# EAGLE schematic BuckConverter (EAGLE 9.6.2)
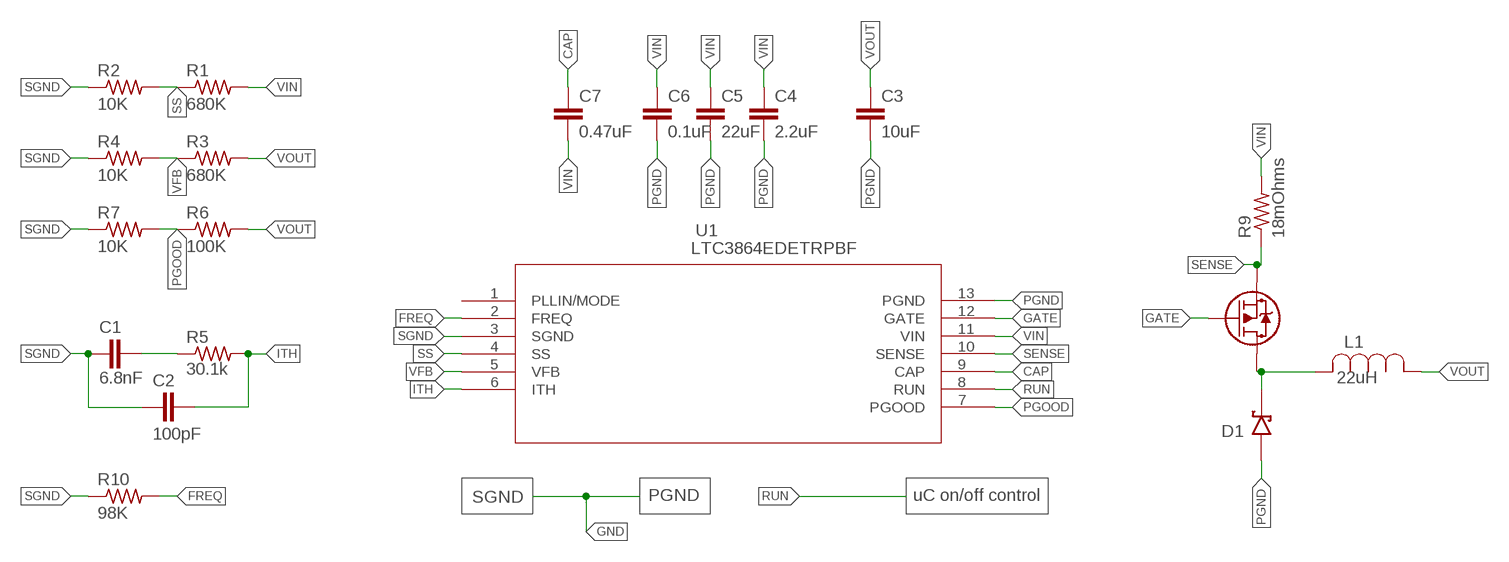
[diagram p0: schematic, sheet 1]

## Parts
C1  6.8nF  2.2UF-0805-25V-(+80/-20%)  [0805]
C2  100pF  2.2UF-0805-25V-(+80/-20%)  [0805]
C3  10uF  2.2UF-0805-25V-(+80/-20%)  [0805]
C4  2.2uF  2.2UF-0805-25V-(+80/-20%)  [0805]
C5  22uF  2.2UF-0805-25V-(+80/-20%)  [0805]
C6  0.1uF  2.2UF-0805-25V-(+80/-20%)  [0805]
C7  0.47uF  2.2UF-0805-25V-(+80/-20%)  [0805]
D1  MBR1560STR  [DIO_MBR1560STR]
L1  22uH  IHLP4040DZER6R8M01  [IND_IHLP-4040DZ_VIS]
R1  680K  R-US_M0805  [M0805]
R2  10K  R-US_M0805  [M0805]
R3  680K  R-US_M0805  [M0805]
R4  10K  R-US_M0805  [M0805]
R5  30.1k  R-US_M0805  [M0805]
R6  100K  R-US_M0805  [M0805]
R7  10K  R-US_M0805  [M0805]
R8  RSJ250P10TL  [TRANS_R5009FNJ_ROM]
R9  18mOhms  R-US_M0805  [M0805]
R10  98K  R-US_M0805  [M0805]
U1  LTC3864EDETRPBF  [DFN-12_DE]

## Nets
CAP: C7.1 U1.9(CAP)
FREQ: R10.2 U1.2(FREQ)
GATE: R8.1 U1.12(GATE)
ITH: C2.2 R5.2 U1.6(ITH)
N$2: D1.3(K) D1.4(K) L1.2 R8.2
N$3: C1.2 R5.1
PGND: C3.2 C4.2 C5.2 C6.2 D1.1(A) D1.2(A) U1.13(PGND)
PGOOD: R6.1 R7.2 U1.7(PGOOD)
RUN: U1.8(RUN)
SENSE: R8.3 R9.1 U1.10(SENSE)
SGND: C1.1 C2.1 R2.1 R4.1 R7.1 R10.1 U1.3(SGND)
SS: R1.1 R2.2 U1.4(SS)
VFB: R3.1 R4.2 U1.5(VFB)
VIN: C4.1 C5.1 C6.1 C7.2 R1.2 R9.2 U1.11(VIN)
VOUT: C3.1 L1.1 R3.2 R6.2
Unconnected: U1.1(PLLIN/MODE)

## Notes on the sheet
- SGND
- PGND | uC on/off control

## Library data of the parts
C1-C3 C5-C7 = SparkFun-Capacitors:2.2UF: 2.2µF ceramic capacitors A capacitor is a passive two-terminal electrical component used to store electrical energy temporarily in an electric field.; PROD_ID: CAP-11624; VALUE: 2.2uF
C4 = SparkFun-Capacitors:2.2UF: 2.2µF ceramic capacitors A capacitor is a passive two-terminal electrical component used to store electrical energy temporarily in an electric field.; PROD_ID: CAP-11624
D1 = MBR1560STR:MBR1560STR: Diode Schottky 60V 15A Surface Mount TO-277B; DESCRIPTION: Diode Schottky 60 V 15A Surface Mount TO-277B; MF: SMC Diode Solutions; MP: MBR1560STR; PACKAGE: TO-277 SMC Diode Solutions; PURCHASE-URL: https://pricing.snapeda.com/search/part/MBR1560STR/?ref=eda
L1 = CurrentLimiter:IHLP4040DZER6R8M01; COPYRIGHT: Copyright (C) 2022 Ultra Librarian. All rights reserved.; DIGI-KEY_PART_NUMBER_1: 541-1303-1-ND; DIGI-KEY_PART_NUMBER_2: 541-1303-2-ND; DIGI-KEY_PART_NUMBER_3: 541-1303-6-ND; MANUFACTURER_PART_NUMBER: IHLP4040DZER6R8M01; MFR_NAME: Vishay
R1-R7 R9 R10 = adafruit:R-US_: RESISTOR, American symbol
R8 = CurrentLimiter:RSJ250P10TL; COPYRIGHT: Copyright (C) 2022 Ultra Librarian. All rights reserved.; DIGI-KEY_PART_NUMBER_1: RSJ250P10TLCT-ND; DIGI-KEY_PART_NUMBER_2: RSJ250P10TLDKR-ND; DIGI-KEY_PART_NUMBER_3: RSJ250P10TLTR-ND; MANUFACTURER_PART_NUMBER: RSJ250P10TL; MFR_NAME: ROHM Semiconductor
U1 = LTC3864EDETRPBF:LTC3864EDETRPBF; DESCRIPTION: Buck Regulator Positive Output Step-Down - DC-DC Controller IC 12-DFN (4x3); DIGI-KEY_PART_NUMBER: 161-LTC3864EDE#TRPBFTR-ND; MF: Analog Devices; MP: LTC3864EDE#TRPBF; PACKAGE: DFN -12 Analog Devices; PURCHASE-URL: https://pricing.snapeda.com/search/part/LTC3864EDE#TRPBF/?ref=eda